# Altium schematic sheet Driver_rect.SchDoc: Buck Sinc Converter
size A4; Organization: UDESC; Revision: R0; SheetNumber: 4; SheetTotal: 10; DocumentFullPathAndName: PROJETO PSE
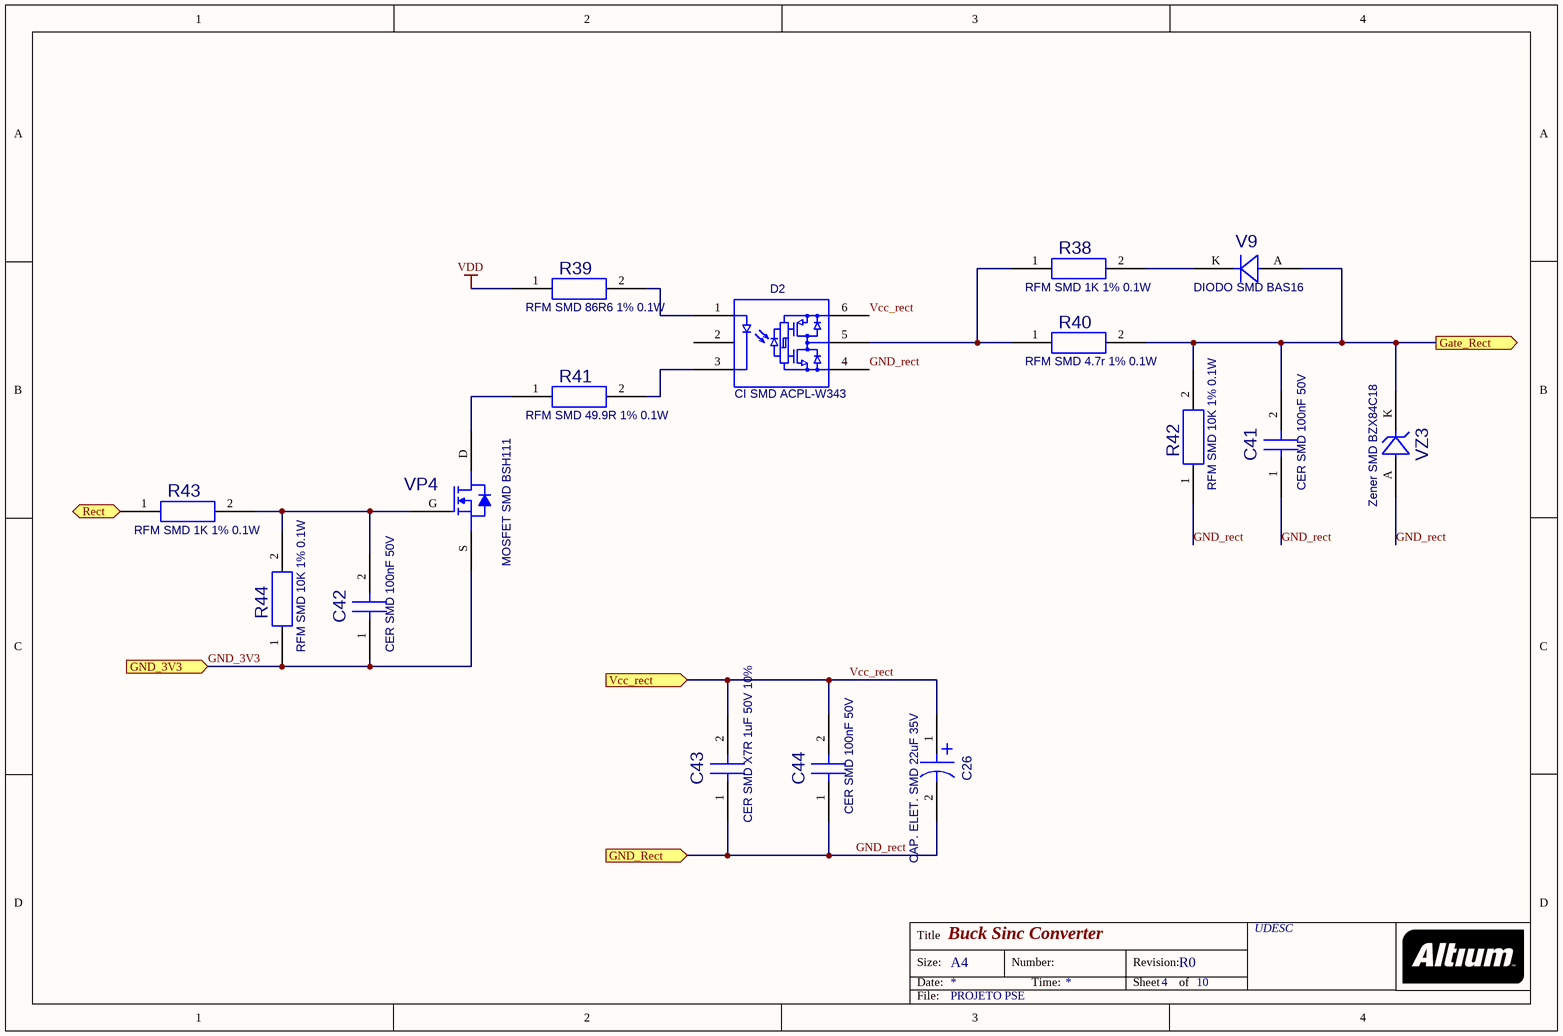
[diagram p0: Driver_rect.SchDoc]

## Parts
C26  value CAP. ELET. SMD 22uF 35V  [CAP UUD CR 5X5.8]  (hidden comment: 11690909)
C41  value CER SMD 100nF 50V  [C0805_R_V0]  (hidden comment: 10192075)
C42  value CER SMD 100nF 50V  [C0805_R_V0]  (hidden comment: 10192075)
C43  value CER SMD X7R 1uF 50V 10%  [C0805_R_V0]  (hidden comment: 11736520)
C44  value CER SMD 100nF 50V  [C0805_R_V0]  (hidden comment: 10192075)
D2  value CI SMD ACPL-W343  [SO-6 (11.5 MM)]  (hidden comment: 12544475)
R38  value RFM SMD 1K 1% 0.1W  [R0805_R_V0]  (hidden comment: 10118077)
R39  value RFM SMD 86R6 1% 0.1W  [R0805_R_V0]  (hidden comment: 10192050)
R40  value RFM SMD 4.7r 1% 0.1W  [R0805_R_V0]  (hidden comment: 10192015)
R41  value RFM SMD 49.9R 1% 0.1W  [R0805_R_V0]  (hidden comment: 10192035)
R42  value RFM SMD 10K 1% 0.1W  [R0805_R_V0]  (hidden comment: 10118076)
R43  value RFM SMD 1K 1% 0.1W  [R0805_R_V0]  (hidden comment: 10118077)
R44  value RFM SMD 10K 1% 0.1W  [R0805_R_V0]  (hidden comment: 10118076)
V9  value DIODO SMD BAS16  [SOT23A]  (hidden comment: 10261302)
VP4  value MOSFET SMD BSH111  [MOS_SOT23A]  (hidden comment: 11110327)
VZ3  value Zener SMD BZX84C18  [ZEN_SOT23A]  (hidden comment: 10050447)

## Ports
Gate_Rect (out), GND_3V3 (in), GND_Rect (in), Rect (in), Vcc_rect (in)

## Nets
VDD: R39.1
Gate_Rect: C41.2 R40.2 R42.2 V9.A VZ3.K ; port Gate_Rect
GND_3V3: C42.1 R44.1 VP4.S ; port GND_3V3
GND_rect: C26.2 C41.1 C43.1 C44.1 D2.4(VEE) R42.1 VZ3.A ; port GND_Rect
Rect: R43.1 ; port Rect
Vcc_rect: C26.1 C43.2 C44.2 D2.6(VCC) ; port Vcc_rect
NetC42_2: C42.2 R43.2 R44.2 VP4.G
NetD2_1: D2.1(A) R39.2
NetD2_3: D2.3(K) R41.2
NetD2_5: D2.5(VOUT) R38.1 R40.1
NetR38_2: R38.2 V9.K
NetR41_1: R41.1 VP4.D

Not connected (* = marked no-connect by the designer): D2 2; V9 NC; VZ3 NC

## Notes on the sheet
- Title
- Size:
- Date:
- A4
- Number:
- Time:
- Revision:
- Sheet
- of
- File:

## Library data of the parts
C26 = 11690909: CAP. ELET. SMD 22uF 35V; HISsym: Atualizado em 20/12/05; TOL: 20%; HISitem: Criado em 02/03/11 (p/ Osnir); Altura: 5,8mm; PN: 11690909; PMT: SMD; ComponenteLink1URL: *
C41 C42 C44 = 10192075: CER SMD 100nF 50V; HISsym: Atualizado em 12/07/05; TOL: 10%; ITEM BAAN: 0333.0044; PN: 10192075; PMT: SMD
C43 = 11736520: CER SMD X7R 1uF 50V 10%; HISsym: Atualizado em 12/07/05; HISitem: Criado em 15/04/11 (p/ Sandro W.); PN: 11736520; PMT: SMD
D2 = 12544475: CI SMD ACPL-W343; HISitem: Criado em 04/04/13 (p/ Geovani); PN: 12544475; PMT: SMD; ComponentLink1URL: http://www.avagotech.com/docs/AV02-2928EN
R38 R43 = 10118077: RFM SMD 1K 1% 0.1W; HISsym: Atualizado em 20/07/05; PN: 10118077; PMT: SMD
R39 = 10118077: RFM SMD 86R6 1% 0.1W; HISsym: Atualizado em 20/07/05; PN: 10192050; PMT: SMD
R40 = 10118077: RFM SMD 4.7r 1% 0.1W; HISsym: Atualizado em 20/07/05; PN: 10192015; PMT: SMD
R41 = 10118077: RFM SMD 49.9R 1% 0.1W; HISsym: Atualizado em 20/07/05; PN: 10192035; PMT: SMD
R42 R44 = 10118077: RFM SMD 10K 1% 0.1W; HISsym: Atualizado em 20/07/05; PN: 10118076; PMT: SMD
V9 = 10261302: DIODO SMD BAS16; HISsym: Atualizado em 17/04/06; VAL: 200mA; PN: 10261302; PMT: SMD
VP4 = 11110327: MOSFET SMD BSH111; HISsym: Atualizado em 12/09/05; HISitem: Criado em 20/12/07 (p/ Ricardo); PN: 11110327; PMT: SMD
VZ3 = 10050447: Zener  SMD BZX84C18; HISsym: Atualizado em 11/07/06; NUMBER PIN: 03; PN: 10050447; PMT: SMD